# EAGLE design Zio Ultrasonic Distance Sensor (EAGLE 9.6.2)
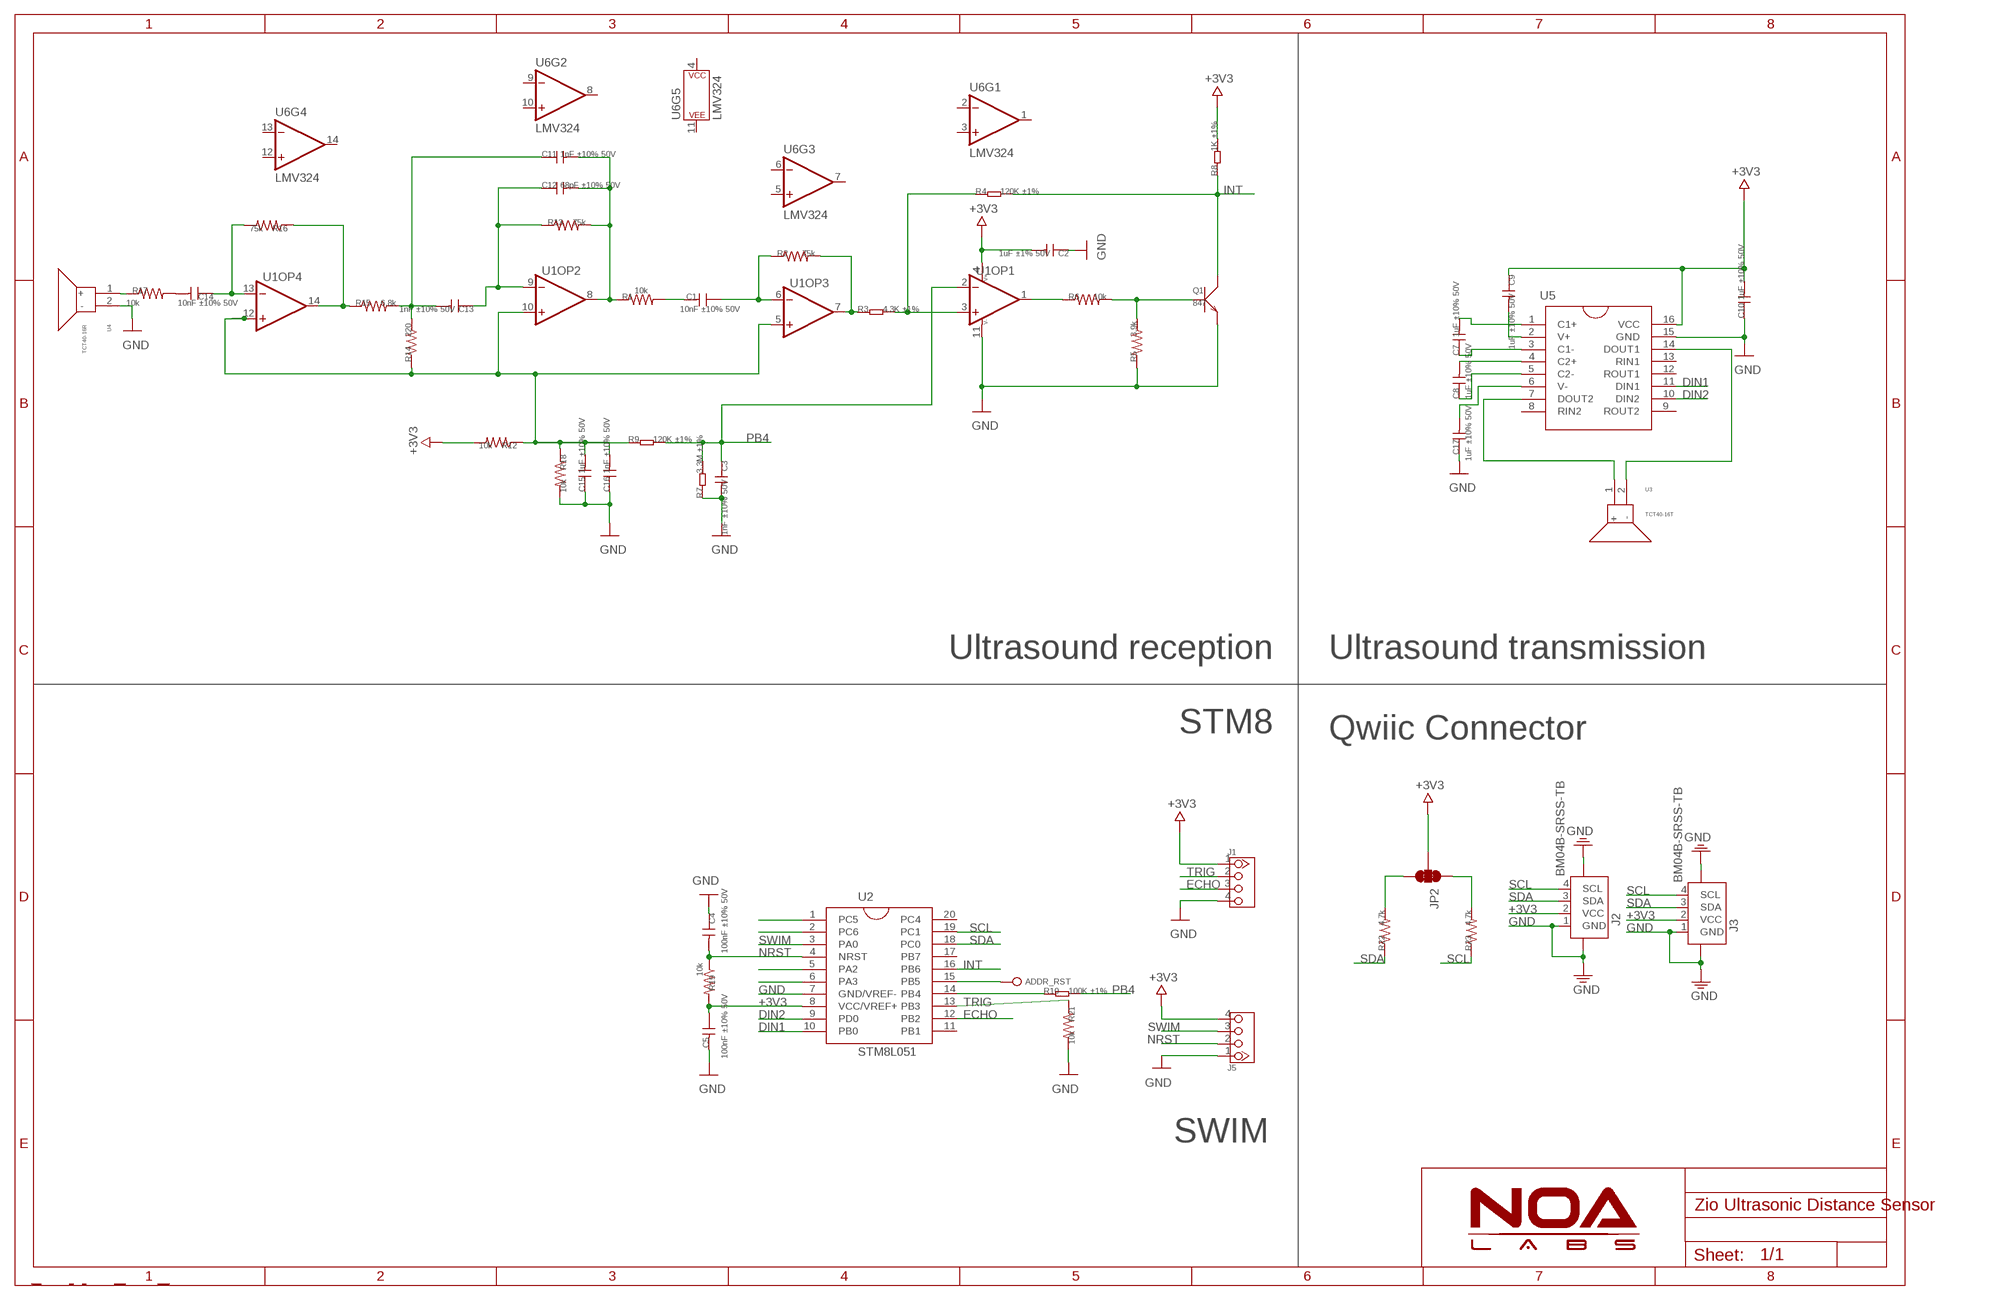
[diagram p0: schematic, sheet 1]

## Parts
ADDR_RST  TEST_POINT35MIL  [1P-35MIL]
C1  10nF ±10% 50V  C-0603  [0603]
C2  1uF ±1% 50V  C-0603  [0603]
C3  1nF ±10% 50V  C-0603  [0603]
C4  100nF ±10% 50V  C-0603  [0603]
C5  100nF ±10% 50V  C-0603  [0603]
C7  1uF ±10% 50V  C-0603  [0603]
C8  1uF ±10% 50V  C-0603  [0603]
C9  1uF ±10% 50V  C-0603  [0603]
C10  1uF ±10% 50V  C-0603  [0603]
C11  1nF ±10% 50V  C-0603  [0603]
C12  68pF ±10% 50V  C-0603  [0603]
C13  1nF ±10% 50V  C-0603  [0603]
C14  10nF ±10% 50V  C-0603  [0603]
C15  1uF ±10% 50V  C-0603  [0603]
C16  1nF ±10% 50V  C-0603  [0603]
C17  1uF ±10% 50V  C-0603  [0603]
J1  HEADER-4P-60/35MIL  [4P-65/35MIL]
J2  BM04B-SRSS-TB  JST-SH-4P  [JST-SH-4P-90]
J3  BM04B-SRSS-TB  JST-SH-4P  [JST-SH-4P-90]
J5  HEADER-4P-TEST_3.08_4P  [TEST_3.08_4P]
JP2  SMT-JUMPER_3_2-NC_TRACE  [SMT-JUMPER_3_2-NC_TRACE]
Q1  847  TRANSISTOR-NPN-SOT23''  [SOT23]
R1  10k  10KOHM-0603-1/10W-1%  [0603]
R2  75k  75KOHM-0603-1/10W-1%  [0603]
R3  4.3K ±1%  R-0603  [0603]
R4  120K ±1%  R-0603  [0603]
R5  3.9k  3.9KOHM-0603-1/10W-1%  [0603]
R6  10k  10KOHM-0603-1/10W-1%  [0603]
R7  3.3M ±1%  R-0603  [0603]
R8  1K ±1%  R-0603  [0603]
R9  120K ±1%  R-0603  [0603]
R10  100K ±1%  R-0603  [0603]
R12  10k  10KOHM-0603-1/10W-1%  [0603]
R13  75k  75KOHM-0603-1/10W-1%  [0603]
R14  220  220OHM-0603-1/10W-1%  [0603]
R15  6.8k  6.8KOHM-0603-1/10W-1%  [0603]
R16  75k  75KOHM-0603-1/10W-1%  [0603]
R17  10k  10KOHM-0603-1/10W-1%  [0603]
R18  10k  10KOHM-0603-1/10W-1%  [0603]
R19  10k  10KOHM-0603-1/10W-1%  [0603]
R21  10k  10KOHM-0603-1/10W-1%  [0603]
R22  4.7k  4.7KOHM-0603-1/10W-1%  [0603]
R23  4.7k  4.7KOHM-0603-1/10W-1%  [0603]
U1  LMV324  [SO014]
U2  STM8L051  [TSSOP20]
U3  TCT40-16T  TCT40-16T/R  [TCT40-16T/R]
U4  TCT40-16R  TCT40-16T/R  [TCT40-16T/R]
U5  UT3232G-S16-RSOIC-16  [SOIC16]
U6  LMV324  [SO14]

## Nets
+3V3: C2.2 C5.1 C9.1 C10.2 J1.1 J2.2(VCC) J3.2(VCC) J5.4 JP2.2 R8.2 R12.2 R19.2 U1.4(OP1:V+) U2.8(VCC/VREF+) U5.16(VCC)
DIN1: U2.10(PB0) U5.11(DIN1)
DIN2: U2.9(PD0) U5.10(DIN2)
ECHO: J1.3 U2.12(PB2)
GND: C2.1 C3.2 C4.1 C5.2 C10.1 C15.1 C16.1 C17.1 J1.4 J2.1(GND) J2.5 J2.6 J3.1(GND) J3.5 J3.6 J5.1 Q1.2(E) R5.1 R7.1 R18.2 R21.2 U1.11(OP1:V-) U2.7(GND/VREF-) U4.2(-) U5.15(GND)
INT: Q1.3(C) R4.2 R8.1 U2.16(PB6)
N$1: R2.2 R3.1 U1.7(OP3:OUT)
N$2: C1.1 R2.1 U1.6(OP3:IN-)
N$3: C1.2 R1.2
N$4: R3.2 R4.1 U1.3(OP1:IN+)
N$5: Q1.1(B) R5.2 R6.2
N$6: R6.1 U1.1(OP1:OUT)
N$7: C7.2 U5.1(C1+)
N$9: C12.1 C13.1 R13.1 U1.9(OP2:IN-)
N$10: C11.2 C12.2 R1.1 R13.2 U1.8(OP2:OUT)
N$11: C15.2 C16.2 R9.1 R12.1 R14.1 R18.1 U1.5(OP3:IN+) U1.10(OP2:IN+) U1.12(OP4:IN+)
N$12: C11.1 C13.2 R14.2 R15.2
N$13: C7.1 U5.3(C1-)
N$14: R15.1 R16.1 U1.14(OP4:OUT)
N$15: C14.1 R16.2 U1.13(OP4:IN-)
N$16: C14.2 R17.2
N$17: C8.2 U5.4(C2+)
N$18: C8.1 U5.5(C2-)
N$19: JP2.3 R22.2
N$20: JP2.1 R23.2
N$22: C9.2 U5.2(V+)
N$23: C17.2 U5.6(V-)
N$24: U3.2(-) U5.14(DOUT1)
N$25: U3.1(+) U5.7(DOUT2)
N$26: R17.1 U4.1(+)
N$27: ADDR_RST.P$1 U2.15(PB5)
N$28: R10.1 U2.14(PB4)
N$42: U2.5(PA2)
N$43: U2.6(PA3)
N$44: U2.2(PC6)
N$45: U2.1(PC5)
NRST: C4.2 J5.2 R19.1 U2.4(NRST)
PB4: C3.1 R7.2 R9.2 R10.2 U1.2(OP1:IN-)
SCL: J2.4(SCL) J3.4(SCL) R23.1 U2.19(PC1)
SDA: J2.3(SDA) J3.3(SDA) R22.1 U2.18(PC0)
SWIM: J5.3 U2.3(PA0)
TRIG: J1.2 R21.1 U2.13(PB3)
Unconnected: U2.11(PB1) U2.17(PB7) U2.20(PC4) U5.8(RIN2) U5.9(ROUT2) U5.12(ROUT1) U5.13(RIN1) U6.1(OUT) U6.2(-IN) U6.3(+IN) U6.4(P$V+) U6.5(+IN) U6.6(-IN) U6.7(OUT) U6.8(OUT) U6.9(-IN) U6.10(+IN) U6.11(P$V-) U6.12(+IN) U6.13(-IN) U6.14(OUT)

## Notes on the sheet
- Ultrasound reception
- Ultrasound transmission
- STM8
- Qwiic Connector
- SWIM

## Library data of the parts
ADDR_RST = Connector:TEST_POINT
C1-C5 C7-C17 = Discretex:C*: Ceramic Capacitors
J1 J5 = Connector:HEADER-4P
J2 J3 = Connector:JST-SH-4P
JP2 = NOA-Jumpers:SMT-JUMPER_3_2-NC_TRACE
Q1 = Discrete:TRANSISTOR-NPN*: NPN audion
R1 R6 R12 R17-R19 R21 = SparkFun-Resistors:10KOHM: 10kΩ resistor A resistor is a passive two-terminal electrical component that implements electrical resistance as a circuit element. Resistors act to reduce current flow, and, at the same time, act to lower voltage levels within circuits. - Wikipedia; PROD_ID: RES-00824
R2 R13 R16 = SparkFun-Resistors:75KOHM: 75kΩ resistor A resistor is a passive two-terminal electrical component that implements electrical resistance as a circuit element. Resistors act to reduce current flow, and, at the same time, act to lower voltage levels within circuits. - Wikipedia; PROD_ID: RES-09737
R3 R4 R7-R10 = Discretex:R*
R5 = SparkFun-Resistors:3.9KOHM: 3.9kΩ resistor A resistor is a passive two-terminal electrical component that implements electrical resistance as a circuit element. Resistors act to reduce current flow, and, at the same time, act to lower voltage levels within circuits. - Wikipedia; PROD_ID: RES-08701
R14 = SparkFun-Resistors:220OHM: 220Ω resistor A resistor is a passive two-terminal electrical component that implements electrical resistance as a circuit element. Resistors act to reduce current flow, and, at the same time, act to lower voltage levels within circuits. - Wikipedia; PROD_ID: RES-07861
R15 = SparkFun-Resistors:6.8KOHM: 6.8kΩ resistor A resistor is a passive two-terminal electrical component that implements electrical resistance as a circuit element. Resistors act to reduce current flow, and, at the same time, act to lower voltage levels within circuits. - Wikipedia; PROD_ID: RES-08597
R22 R23 = SparkFun-Resistors:4.7KOHM: 4.7kΩ resistor A resistor is a passive two-terminal electrical component that implements electrical resistance as a circuit element. Resistors act to reduce current flow, and, at the same time, act to lower voltage levels within circuits. - Wikipedia; PROD_ID: RES-07857
U1 = IC:LMV324: General purpose LOW Voltage, Rail-to-Rail Output Amplifiers http://www.fairchildsemi.com/ds/LM/LMV358.pdf
U2 = IC:STM8L051
U3 U4 = Discretex:TCT40-16T/R
U5 = IC:UT3232G-S16-R
U6 = SparkFun-IC-Amplifiers:LMV324: IC LMV324 Quad Op Amp Jellybean quad op-amp Datasheet <http://cdn.sparkfun.com/datasheets/Sensors/Sound/LMV324.pdf> SparkFun Products SparkFun Sensor Kit <https://www.sparkfun.com/products/13754> (DEV-13754) SparkFun Inventor's Kit for Arduino 101 <https://www.sparkfun.com/products/13844> (KIT-13844) SparkFun Sound Detector <https://www.sparkfun.com/products/12642> (SEN-12642); PROD_ID: IC-08227

## Board
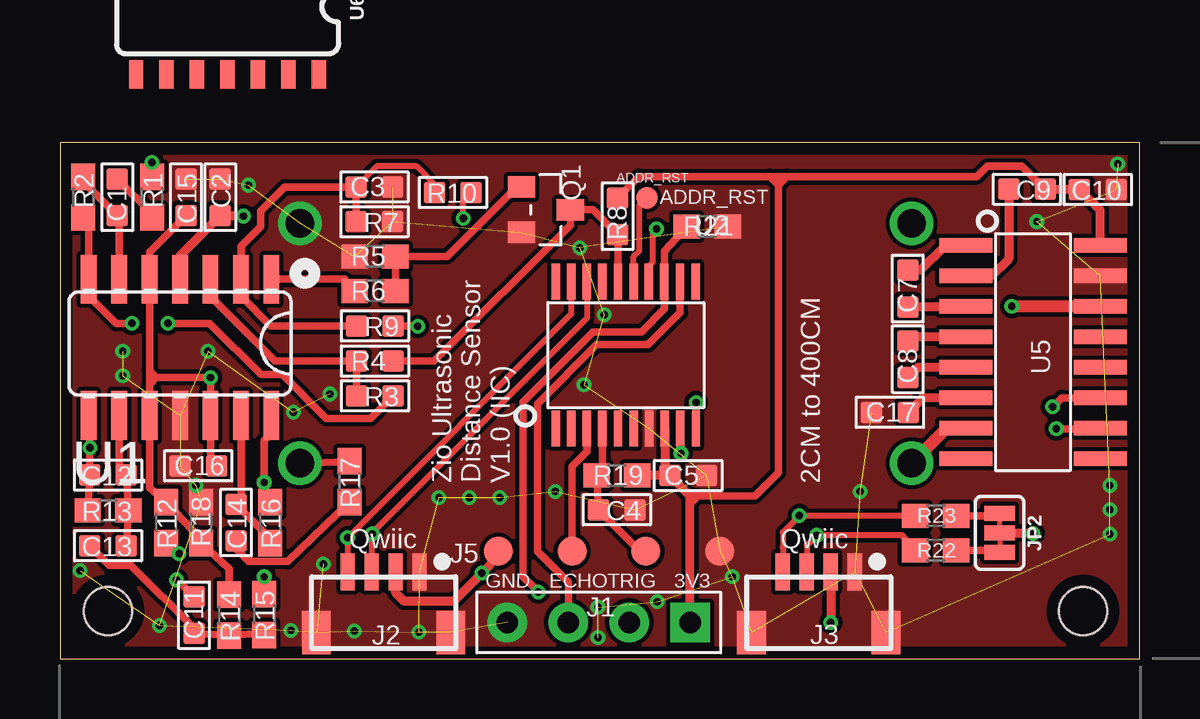
[diagram p1: board, top side]
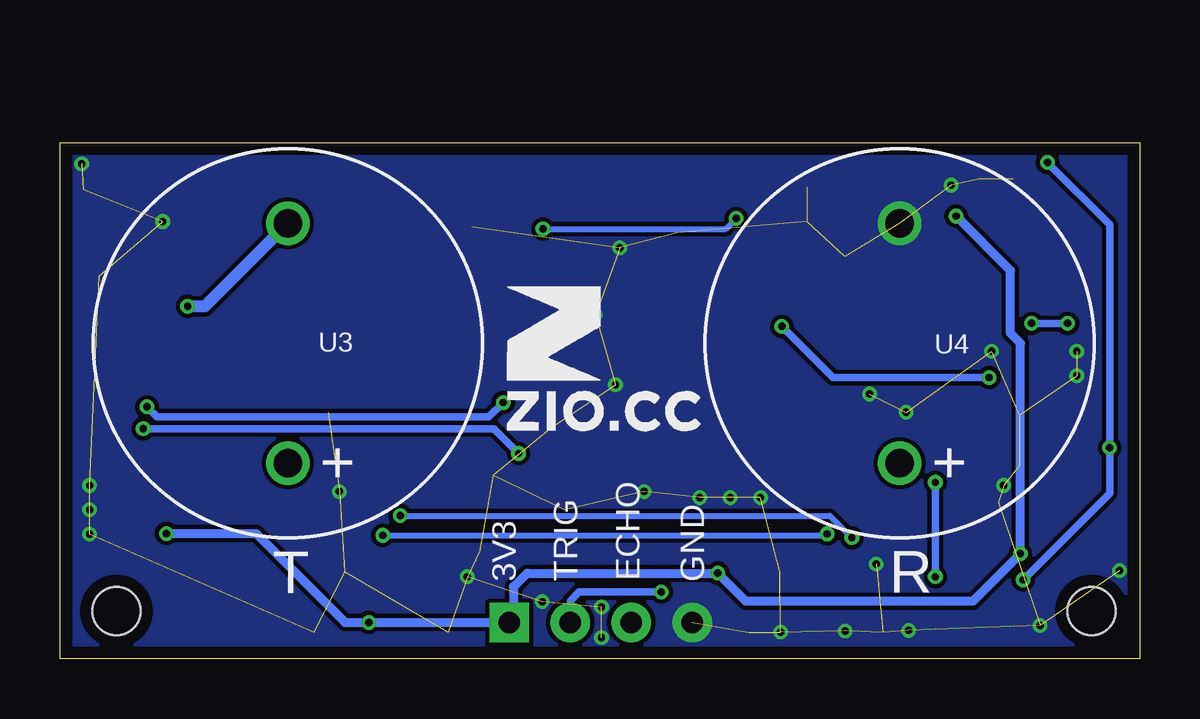
[diagram p2: board, bottom side, seen from below]

Size 45 x 21.54 mm. Coordinates in mm from the lower left corner, seen from the top.
Outline: 0,0 45,0 45,21.54 0,21.54 0,0
Copper layers (1*16): Top 0.035mm / dielectric 1.5mm / Bottom 0.035mm
Design rules "NOA Eagle Rule": minimum track width 7mil, minimum drill 12mil, track to track 7mil, track to pad 7mil, pad to pad 7mil, via to via 7mil, smd to smd 0mil, copper to edge 20mil, drill to drill 10mil, minimum pad ring 10mil, minimum via ring 6mil, stop-mask expansion 2mil, vias tented up to drill 25mil, thermal gap 10mil
Holes 2 mm at 2,2 42.64,2

### Footprints (pad centres in the part's own frame; a part is rotated, then mirrored left to right if it is on the bottom)
1P-35MIL = smd 0.889 x 0.889: P$1 0,0
0603 = smd 0.889 x 0.889: 1 -0.762,0; 2 0.762,0
4P-65/35MIL = drill 0.889 pad 1.651 square: 1 0,3.81 | drill 0.889 pad 1.651: 2 0,1.27; 3 0,-1.27; 4 0,-3.81
JST-SH-4P-90 = smd 0.6 x 1.55: 1 -1.5,0; 2 -0.5,0; 3 0.5,0; 4 1.5,0 | smd 1.2 x 1.8: 5 -2.8,2.525; 6 2.8,2.525
TEST_3.08_4P = smd 1.2 x 1.2: 1 -4.62,0; 2 -1.54,0; 3 1.54,0; 4 4.62,0
SMT-JUMPER_3_2-NC_TRACE = smd 0.635 x 1.27: 1 -0.813,0; 2 0,0; 3 0.813,0
SOT23 = smd 0.889 x 1.143: 1 -0.95,-1.016; 2 0.95,-1.016; 3 0,1.016
0603' = smd 1.1 x 1: 1 -0.85,0; 2 0.85,0
SO014 = smd 0.66 x 2.032: 1 -3.175,-2.68; 2 -1.905,-2.68; 3 -0.635,-2.68; 4 0.635,-2.68; 5 1.905,-2.68; 6 3.175,-2.68; 7 4.445,-2.68; 8 4.445,2.997; 9 3.175,2.997; 10 1.905,2.997; 11 0.635,2.997; 12 -0.635,2.997; 13 -1.905,2.997; 14 -3.175,2.997
TSSOP20 = smd 0.35 x 1.5: 1 -2.925,-3.065; 2 -2.275,-3.065; 3 -1.625,-3.065; 4 -0.975,-3.065; 5 -0.325,-3.065; 6 0.325,-3.065; 7 0.975,-3.065; 8 1.625,-3.065; 9 2.275,-3.065; 10 2.925,-3.065; 11 2.91,3.065; 12 2.26,3.065; 13 1.61,3.065; 14 0.96,3.065; 15 0.325,3.065; 16 -0.325,3.065; 17 -0.975,3.065; 18 -1.625,3.065; 19 -2.275,3.065; 20 -2.925,3.065
TCT40-16T/R = drill 1.2: 1 -5,0; 2 5,0
SOIC16 = smd 0.6 x 2.2: 1 -4.445,-2.8; 2 -3.175,-2.8; 3 -1.905,-2.8; 4 -0.635,-2.8; 5 0.635,-2.8; 6 1.905,-2.8; 7 3.175,-2.8; 8 4.445,-2.8; 9 4.445,2.8; 10 3.175,2.8; 11 1.905,2.8; 12 0.635,2.8; 13 -0.635,2.8; 14 -1.905,2.8; 15 -3.175,2.8; 16 -4.445,2.8
SO14 = smd 0.6 x 1.2: 1 -3.175,-2.8; 2 -1.905,-2.8; 3 -0.635,-2.8; 4 0.635,-2.8; 5 1.905,-2.8; 6 3.175,-2.8; 7 4.445,-2.8; 8 4.445,2.8; 9 3.175,2.8; 10 1.905,2.8; 11 0.635,2.8; 12 -0.635,2.8; 13 -1.905,2.8; 14 -3.175,2.8

### Placement (x,y rotation side)
ADDR_RST  24.46,19.23 0 top
C1  2.39,19.25 90 top
C2  6.68,19.25 270 top
C3  13.11,19.68 0 top
C4  23.22,6.22 180 top
C5  26.19,7.65 0 top
C7  35.34,15.45 90 top
C8  35.34,12.5 90 top
C9  40.3,19.58 180 top
C10  43.26,19.57 180 top
C11  5.59,1.83 90 top
C12  2.01,7.67 180 top
C13  2.01,4.72 180 top
C14  7.34,5.69 270 top
C15  5.26,19.25 270 top
C16  5.77,8.05 0 top
C17  34.59,10.28 0 top
J1  22.46,1.52 270 top
J2  13.49,3.63 180 top
J3  31.63,3.63 180 top
J5  22.89,4.5 180 top
JP2  39.17,5.26 270 top
Q1  20.26,18.73 270 top
R1  10k  [0603']  3.84,19.25 270 top
R2  75k  [0603']  0.97,19.25 270 top
R3  13.13,10.97 180 top
R4  13.13,12.42 0 top
R5  3.9k  [0603']  13.13,16.79 0 top
R6  10k  [0603']  13.13,15.34 0 top
R7  13.11,18.24 180 top
R8  23.24,18.47 90 top
R9  13.13,13.89 180 top
R10  16.38,19.46 180 top
R12  10k  [0603']  4.42,5.69 270 top
R13  75k  [0603']  2.01,6.2 180 top
R14  220  [0603']  7.06,1.83 270 top
R15  6.8k  [0603']  8.51,1.85 270 top
R16  75k  [0603']  8.76,5.69 270 top
R17  10k  [0603']  12.06,7.39 270 top
R18  10k  [0603']  5.89,5.69 90 top
R19  10k  [0603']  23.22,7.65 0 top
R21  10k  [0603']  26.98,18.03 0 top
R22  4.7k  [0603']  36.5,4.53 0 top
R23  4.7k  [0603']  36.5,5.98 0 top
U1  5.64,13.16 180 top
U2  23.59,12.67 0 top
U3  35.5,13.17 90 bottom
U4  10,13.17 90 bottom
U5  40.56,12.8 270 top
U6  7.62,27.18 180 top
U$5  [6MM]  26.39,9.53 0 bottom

### Tracks (layer width: path | path; a pad name or v marks a point on that pad's centre or on a via)
+3V3  (via drill 0.3)
  Top 0.305: R8.2 24.13,20.12 29.59,20.12 | 41.08,19.57 40.1,20.55 38.66,20.55 38.23,20.12 30.3,20.12 | 29.59,20.12 30.3,20.12 | 26.27,6.8 26.59,6.8 | 26.59,6.8 28.98,6.8 29.95,7.77 29.95,19.76 | 29.95,19.76 30.3,20.12 | 29.95,19.76 29.59,20.12 | 26.27,6.48 26.59,6.8
  Top 0.381: U1.4 5,16.82 C2.2 7.62,18.49 v7.64,18.47 | U2.8 25.21,7.86 C5.1 | C5.1 R19.2 | R12.2 4.95,4.39 v4.97,4.39 | J5.4 18.27,4.27 v17.58,3.58 16.41,2.41 14.35,2.41 13.99,2.77 J2.2 | JP2.2 40.54,5.26 v40.56,5.23 | J1.1 26.27,6.48 26.27,6.8 C5.1 | J3.2 v32.13,1.53 v32.13,1.52 | U5.16 43.36,18.71 C10.2 41.08,19.57 C9.1
  Bottom 0.381: v7.64,18.47 5.38,16.2 5.38,13.59 4.97,13.17 v4.97,4.39 6.95,2.41 16.41,2.41 v17.58,3.58 25.53,3.58 26.1,3.01 26.1,1.69 J1.1 v32.13,1.52 33.12,1.52 36.83,5.23 v40.56,5.23
DIN1  (via drill 0.3)
  Top 0.305: U2.10 26.51,10.69 v26.52,10.69 | v41.38,10.52 41.75,10.89 U5.11
  Bottom 0.305: v26.52,10.69 27.13,10.08 40.95,10.08 v41.38,10.52
DIN2  (via drill 0.3)
  Top 0.305: U2.9 25.86,8.6 v25.88,8.57 | v41.53,9.6 43.34,9.6 U5.10
  Bottom 0.305: v25.88,8.57 26.91,9.6 v41.53,9.6
ECHO
  Top 0.305: U2.12 25.84,14.44 24.51,13.11 22.37,13.11 19.91,10.64 19.91,4.49 21.19,3.21 J1.3
GND  (via drill 0.3)  (54 unrouted)
  other vias: 33.35,6.98 28.02,3.43 22.43,0.89 18.34,6.73 20.65,6.98 21.84,11.43 22.68,14.35 21.67,17.14 2.62,12.83 2.62,11.81 6.17,12.83 11.25,11.05 9.73,10.29 5.66,7.24 4.14,1.4 0.84,3.68 43.76,7.24 43.76,6.22 43.76,5.21 22.43,2.16 24.89,2.39 7.85,19.76 10.97,3.96 9.63,1.19 14.96,1.12 12.27,1.17 44.09,20.65 40.72,18.24 17.07,6.73 15.8,6.73
  pour Top (no thermals): 0,21.54 45.01,21.54 45.01,0 0,0
  pour Bottom (no thermals): 0,21.54 45.01,21.54 45.01,0 0,0
INT
  Top 0.305: R4.2 15.6,12.42 21.27,18.1 Q1.3 22.21,18.73 R8.1 23.26,17.68 U2.16
N$1  (via drill 0.3)
  Top 0.305: R2.2 1.19,18.26 U1.7 1.19,15.14 2.34,14 v3,14 | R3.1 12.95,10.03 11.1,10.03 9.27,11.86 8.38,11.86 6.25,14 v4.5,14
  Bottom 0.305: v4.5,14 v3,14
N$2
  Top 0.305: R2.1 0.96,19.91 C1.1 2.46,18.41 U1.6
N$3
  Top 0.305: R1.2 3.83,18.57 C1.2
N$4
  Top 0.305: U1.3 6.27,15.11 8.97,12.42 R4.1 R3.2
N$5
  Top 0.305: Q1.1 19.02,19.68 16.13,16.79 R5.2 R6.2
N$6
  Top 0.305: U1.1 11.87,15.84 R6.1
N$7
  Top 0.381: U5.1 36.9,17.24 35.87,16.21 C7.2
N$9
  Top 0.305: U1.9 2.46,7.98 C12.1 R13.1 C13.1
N$10  (via drill 0.3)
  Top 0.254: 1.25,10.11 U1.8
  Top 0.305: R13.2 C12.2 v1.25,8.81 1.25,10.11 | R1.1 v3.83,20.7 | C11.2 4.88,3.3 v4.85,3.3
  Bottom 0.305: v3.83,20.7 1.25,18.11 v1.25,8.81 1.25,6.91 v4.85,3.3
N$11  (via drill 0.3)
  Top 0.254: 5.89,4.98 R18.1
  Top 0.305: 5.89,4.98 R12.1 3.73,7.14 U1.10 3.73,11.46 | C16.2 6.27,8.31 U1.12 v6.27,11.73 4.01,11.73 | C15.2 3.73,16.97 U1.5 3.73,12.01 | R14.1 7.06,3.76 R18.1 | R9.1 14.88,13.89 v14.91,13.87 | 3.73,12.01 3.73,11.46 | 4.01,11.73 3.73,12.01 | 4.01,11.73 3.73,11.46
  Bottom 0.305: v14.91,13.87 12.78,11.73 v6.27,11.73
N$12
  Top 0.305: C13.2 2.06,3.91 2.95,3.91 5.59,1.27 C11.1 R14.2 8.48,1.07 R15.2
N$13
  Top 0.381: U5.3 37.74,14.68 C7.1
N$14  (via drill 0.3)
  Top 0.305: R15.1 v8.51,3.43 | R16.1 8.51,6.71 v8.51,7.37 8.51,9.12 8.81,9.42 U1.14
  Bottom 0.305: v8.51,3.43 v8.51,7.37
N$15
  Top 0.254: 8.76,5.03 R16.2
  Top 0.305: U1.13 7.54,6.65 C14.1 8.76,5.03
N$16
  Top 0.305: R17.2 9.5,4.06 7.87,4.06 7.34,4.6 C14.2
N$17
  Top 0.381: U5.4 35.51,13.43 C8.2
N$18
  Top 0.381: U5.5 35.77,12.16 C8.1
N$19
  Top 0.305: R22.2 39.08,4.53 JP2.3
N$20
  Top 0.305: R23.2 39.07,5.98 JP2.1
N$22
  Top 0.381: C9.2 39.54,16.68 38.83,15.97 U5.2
N$23
  Top 0.381: U5.6 35.96,10.89 C17.2
N$24  (via drill 0.3)
  Top 0.508: U5.14 v39.68,14.7 v39.67,14.71
  Bottom 0.508: U3.2 38.96,14.71 v39.67,14.71
N$25
  Top 0.508: U5.7 36.95,9.62 U3.1
N$26
  Top 0.305: R17.1 10.02,8.15 U4.1
N$27
  Top 0.254: U2.15 23.91,16.77 24.16,17.02 24.16,18.92 ADDR_RST.P$1
N$28  (via drill 0.3)
  Top 0.254: U2.14 24.55,16.39 24.71,16.56 24.71,17.78 v24.87,17.93 | v16.81,18.37 16.81,19.12 R10.1
  Bottom 0.254: v16.81,18.37 17.25,17.93 v24.87,17.93
NRST
  Top 0.305: U2.4 22.61,7.8 R19.1 C4.2 24.18,4.5 J5.2
PB4
  Top 0.254: R10.2 15.62,19.79 14.86,20.55 13.21,20.55 C3.1
  Top 0.305: R7.2 C3.1 9.37,19.68 8.36,18.67 8.36,18.03 7.54,17.22 U1.2 7.54,15.14 8.79,13.89 R9.2
SCL  (via drill 0.3)
  Top 0.254: U2.19 21.31,14.38 v11.99,5.06 J2.4 | R23.1 v30.82,5.98 30.13,5.29 30.13,4.65 30.13,3.74 J3.4
  Top 0.305: 30.13,3.74 30.18,3.69
  Bottom 0.254: v30.82,5.98 12.91,5.98 v11.99,5.06
SDA  (via drill 0.3)
  Top 0.254: U2.18 21.96,14.21 12.99,5.24 12.99,5.19 | J2.3 12.99,4.17 12.99,5.19 | R22.1 35.11,5.16 v31.55,5.16 31.13,4.74 J3.3 | v13.02,5.22 12.99,5.19
  Bottom 0.254: v31.55,5.16 13.08,5.16 v13.02,5.22
SWIM
  Top 0.305: U2.3 21.96,8.65 21.34,8.04 J5.3
TRIG  (via drill 0.3)
  Top 0.305: v19.94,2.79 19.3,3.43 19.3,10.72 22.23,13.64 24.23,13.64 25.2,14.6 U2.13 25.2,17.01 R21.1
  Bottom 0.305: J1.2 23.73,2.43 23.37,2.79 v19.94,2.79

### Text on the board
tPlace: ADDR_RST | Zio Ultrasonic / Distance Sensor / V1.0 (IIC) | 2CM to 400CM | Qwiic | Qwiic | GND | ECHO | TRIG | 3V3
bPlace: R | GND | ECHO | TRIG | 3V3 | T